# Altium schematic sheet SBH_Microcontroller.SchDoc: Microcontroller
size B; Date: 10/12/2022; Author: Ethan Garrett; Organization: ORGANIZATION; Address1: ADDRESS 1; Address2: ADDRESS 2; Address3: ADDRESS 3; Address4: ADDRESS 4; Revision: -; SheetNumber: 1; SheetTotal: 3; ENG_APP_DATE: --/--/--; DSN_APP_DATE: --/--/--; CHK_APP_DATE: --/--/--
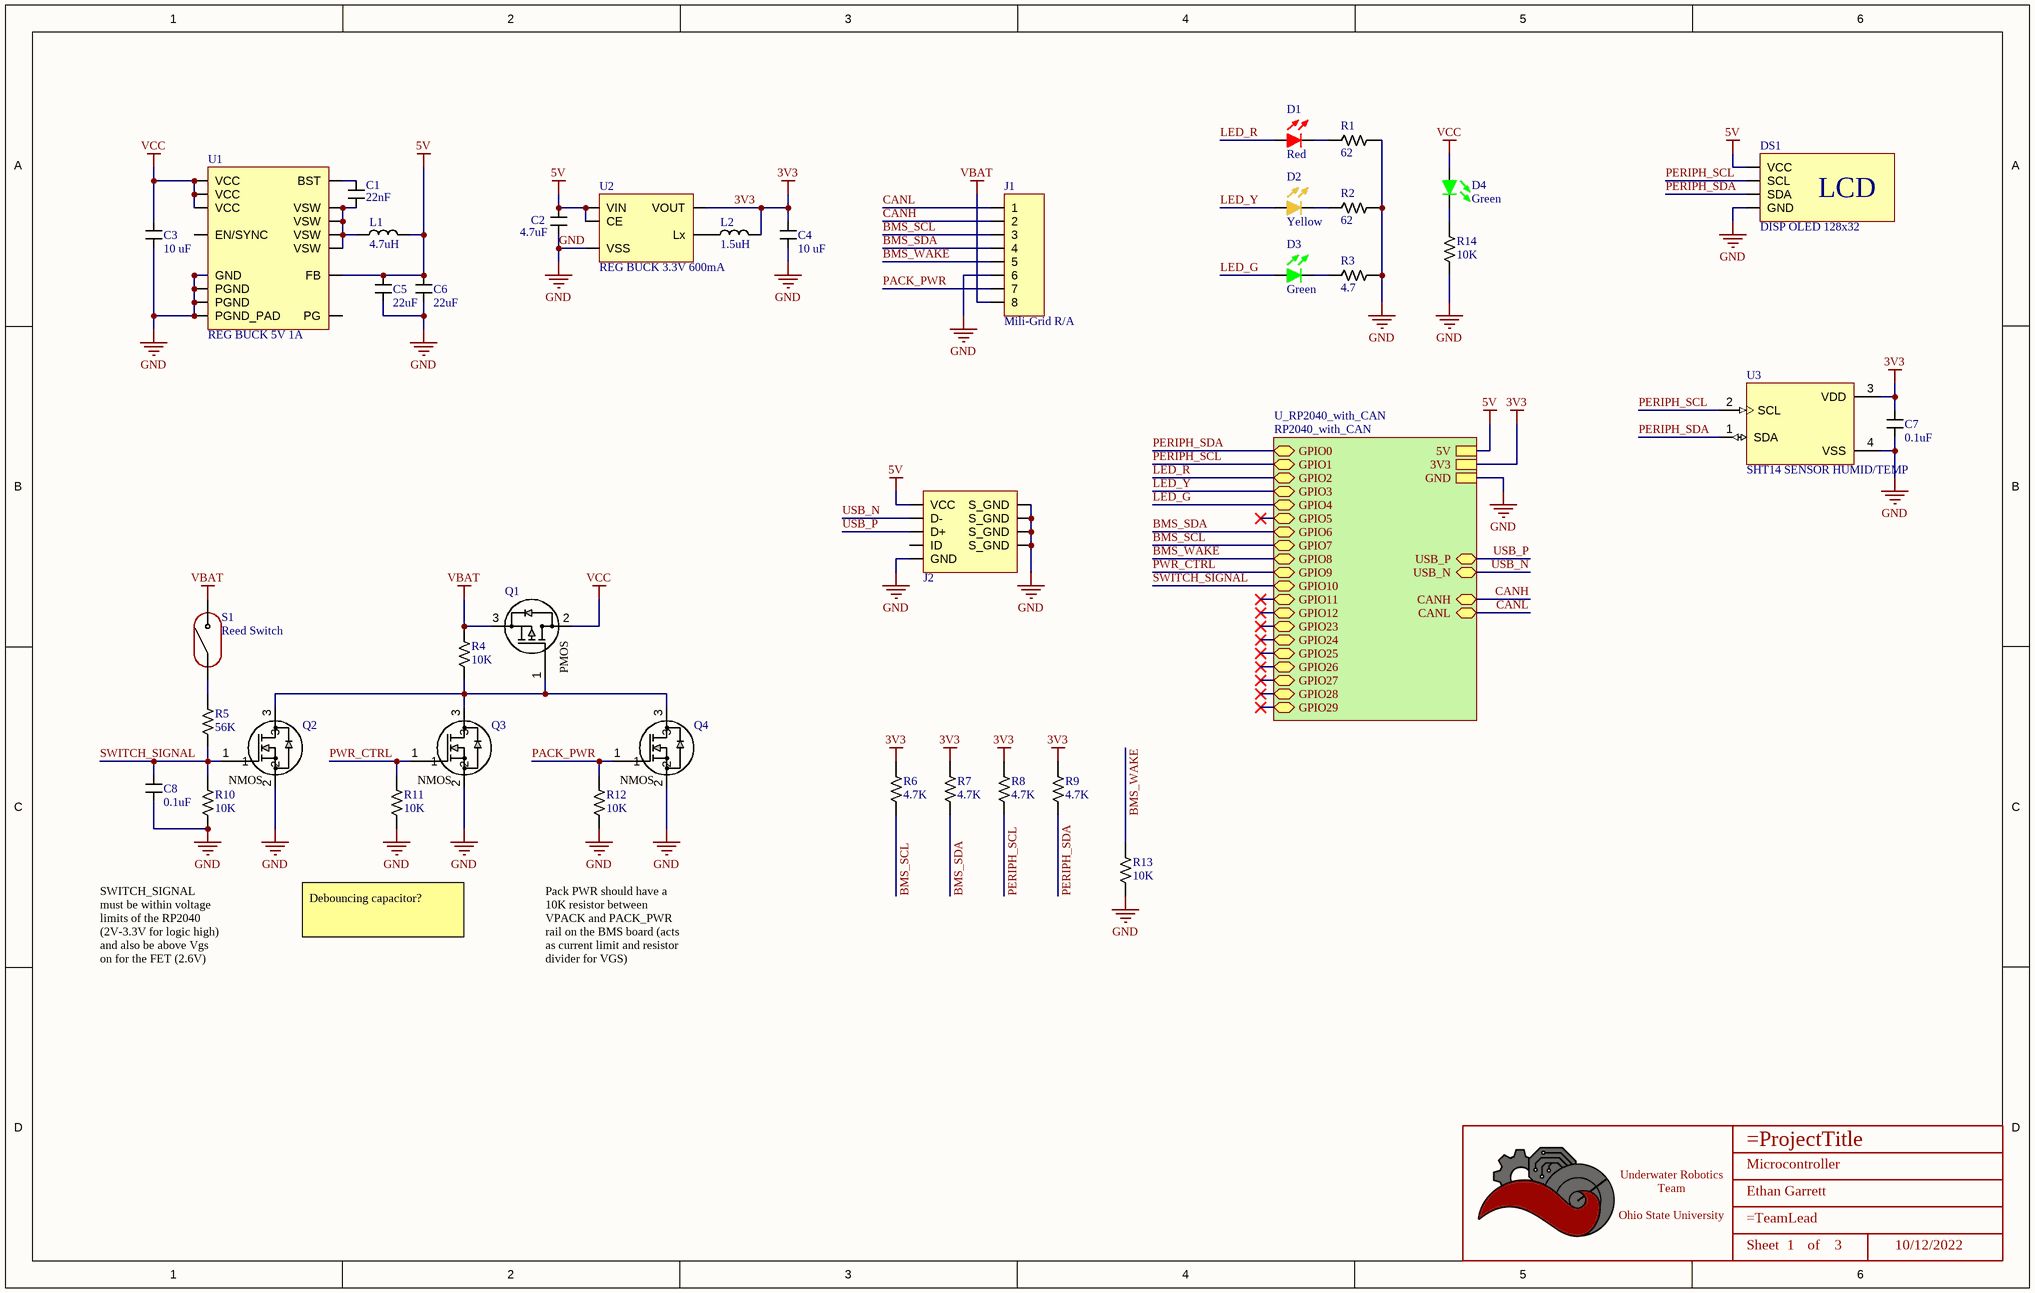
[diagram p0: SBH_Microcontroller.SchDoc]

## Parts
*  Title_Block  [LOGO]  (value not drawn)  (graphical)
C1  value 22nF  [CAPACITOR_0402]  (hidden comment: 22nF Ceramic 25V)
C2  value 4.7uF  [CAPACITOR_0603]  (hidden comment: 4.7uF Ceramic 6.3V)
C3  Value (uF): 10 uF  [CAPACITOR_1206]  (hidden comment: 10uF Ceramic 25V)
C4  Value (uF): 10 uF  [CAPACITOR_0603]  (hidden comment: 10uF Ceramic 6.3V)
C5  value 22uF  [CAPACITOR_0805]  (hidden comment: 22uF Ceramic 10V)
C6  value 22uF  [CAPACITOR_0805]  (hidden comment: 22uF Ceramic 10V)
C7  value 0.1uF  [CAPACITOR_0402]  (hidden comment: 100nF Ceramic 25V)
C8  value 0.1uF  [CAPACITOR_0402]  (hidden comment: 100nF Ceramic 25V)
D1  Color: Red  [LED_0603]  (hidden comment: 150060RS75000)
D2  Color: Yellow  [LED_0603]  (hidden comment: 150060YS75000)
D3  Color: Green  [LED_0603]  (hidden comment: 150060GS75000)
D4  Color: Green  [LED_0603]  (hidden comment: 150060GS75000)
DS1  DISP OLED 128x32  [OLED_I2C_128x32]
J1  Mili-Grid R/A  [Molex_Mili-Grid_2x4PIN_2.00MM_RA]
J2  USB_MICRO R/A  [CONN_MINIUSB]  (value not drawn)
L1  value 4.7uH  [INDUCTOR_SLF7045]  (hidden comment: 4.7uH Shielded Drum Core)
L2  value 1.5uH  [INDUCTOR_NR3015]  (hidden comment: 1.5uH Shielded)
Q1  DMP3056L-7  [SOT-23-3]  (value not drawn)
Q2  MOSFET N-CH 30V 5.8A SOT-23-3  [SOT-23-3]  (value not drawn)
Q3  MOSFET N-CH 30V 5.8A SOT-23-3  [SOT-23-3]  (value not drawn)
Q4  MOSFET N-CH 30V 5.8A SOT-23-3  [SOT-23-3]  (value not drawn)
R1  Value  (Ohms): 62  [RESISTOR_0603]  (hidden comment: 62 Ohm 1% 1/4W)
R2  Value  (Ohms): 62  [RESISTOR_0603]  (hidden comment: 62 Ohm 1% 1/4W)
R3  Value  (Ohms): 4.7  [RESISTOR_0603]  (hidden comment: 4.7 Ohm 5% 1/8W)
R4  Value  (Ohms): 10K  [RESISTOR_0603]  (hidden comment: 10k Ohm 5% 1/10W)
R5  Value  (Ohms): 56K  [RESISTOR_0402]  (hidden comment: 56k Ohm 1% 1/16W)
R6  Value  (Ohms): 4.7K  [RESISTOR_0603]  (hidden comment: 4.7k Ohm 5% 1/10W)
R7  Value  (Ohms): 4.7K  [RESISTOR_0603]  (hidden comment: 4.7k Ohm 5% 1/10W)
R8  Value  (Ohms): 4.7K  [RESISTOR_0603]  (hidden comment: 4.7k Ohm 5% 1/10W)
R9  Value  (Ohms): 4.7K  [RESISTOR_0603]  (hidden comment: 4.7k Ohm 5% 1/10W)
R10  Value  (Ohms): 10K  [RESISTOR_0603]  (hidden comment: 10k Ohm 5% 1/10W)
R11  Value  (Ohms): 10K  [RESISTOR_0603]  (hidden comment: 10k Ohm 5% 1/10W)
R12  Value  (Ohms): 10K  [RESISTOR_0603]  (hidden comment: 10k Ohm 5% 1/10W)
R13  Value  (Ohms): 10K  [RESISTOR_0603]  (hidden comment: 10k Ohm 5% 1/10W)
R14  Value  (Ohms): 10K  [RESISTOR_0603]  (hidden comment: 10k Ohm 5% 1/10W)
S1  Reed Switch  [MDSR-7]
U1  REG BUCK 5V 1A  [QFN-16 (3x3)]
U2  REG BUCK 3.3V 600mA  [SOT-23-5]
U3  SHT14 SENSOR HUMID/TEMP  [XDCR_SHT41-AD1B-R2]

## Sub-sheets
U_RP2040_with_CAN = RP2040_with_CAN: USB_P (bidir), USB_N (bidir), 5V, CANH (bidir), CANL (bidir), GPIO0 (bidir), GPIO1 (bidir), GPIO2 (bidir), GPIO3 (bidir), GPIO4 (bidir), GPIO5 (bidir), GPIO6 (bidir), GPIO7 (bidir), GPIO8 (bidir), GPIO9 (bidir), GPIO10 (bidir), GPIO11 (bidir), GPIO12 (bidir), GPIO23 (bidir), GPIO24 (bidir), GPIO25 (bidir), GPIO26 (bidir), GPIO27 (bidir), GPIO28 (bidir), GPIO29 (bidir), 3V3, GND

## Nets
3V3: C4.1 C7.1 L2.1 R6.1 R7.1 R8.1 R9.1 U2.4(VOUT) U3.3(VDD) ; sheet U_RP2040_with_CAN/3V3
5V: C2.1 C5.1 C6.1 DS1.2(VCC) J2.1(VCC) L1.1 U1.5(FB) U2.1(VIN) U2.3(CE) ; sheet U_RP2040_with_CAN/5V
GND: C2.2 C3.2 C4.2 C5.2 C6.2 C7.2 C8.2 DS1.1(GND) J1.6 J2.5(GND) J2.6(S_GND) J2.7(S_GND) J2.8(S_GND) J2.9(S_GND) Q2.2 Q3.2 Q4.2 R1.1 R2.1 R3.1 R10.2 R11.2 R12.2 R13.2 R14.2 U1.4(GND) U1.14(PGND) U1.15(PGND) U1.17(PGND_PAD) U2.2(VSS) U3.4(VSS) ; sheet U_RP2040_with_CAN/GND
VBAT: J1.8 Q1.3 R4.1 S1.2
VCC: C3.1 D4.1 Q1.2 U1.2(VCC) U1.3(VCC) U1.11(VCC)
BMS_SCL: J1.3 R6.2 ; sheet U_RP2040_with_CAN/GPIO7
BMS_SDA: J1.4 R7.2 ; sheet U_RP2040_with_CAN/GPIO6
BMS_WAKE: J1.5 R13.1 ; sheet U_RP2040_with_CAN/GPIO8
CANH: J1.2 ; sheet U_RP2040_with_CAN/CANH
CANL: J1.1 ; sheet U_RP2040_with_CAN/CANL
LED_G: D3.1 ; sheet U_RP2040_with_CAN/GPIO4
LED_R: D1.1 ; sheet U_RP2040_with_CAN/GPIO2
LED_Y: D2.1 ; sheet U_RP2040_with_CAN/GPIO3
PACK_PWR: J1.7 Q4.1 R12.1
PERIPH_SCL: DS1.3(SCL) R8.2 U3.2(SCL) ; sheet U_RP2040_with_CAN/GPIO1
PERIPH_SDA: DS1.4(SDA) R9.2 U3.1(SDA) ; sheet U_RP2040_with_CAN/GPIO0
PWR_CTRL: Q3.1 R11.1 ; sheet U_RP2040_with_CAN/GPIO9
SWITCH_SIGNAL: C8.1 Q2.1 R5.2 R10.1 ; sheet U_RP2040_with_CAN/GPIO10
USB_N: J2.2(D-) ; sheet U_RP2040_with_CAN/USB_N
USB_P: J2.3(D+) ; sheet U_RP2040_with_CAN/USB_P
NetC1_1: C1.1 U1.10(BST)
NetC1_2: C1.2 L1.2 U1.1(VSW) U1.12(VSW) U1.13(VSW) U1.16(VSW)
NetD1_2: D1.2 R1.2
NetD2_2: D2.2 R2.2
NetD3_2: D3.2 R3.2
NetD4_2: D4.2 R14.1
NetL2_2: L2.2 U2.5(Lx)
NetQ1_1: Q1.1 Q2.3 Q3.3 Q4.3 R4.2
NetR5_1: R5.1 S1.1

Not connected (* = marked no-connect by the designer): J2 4(ID); U1 8(PG) 9(EN/SYNC)

## Notes on the sheet
- SWITCH_SIGNAL must be within voltage limits of the RP2040 (2V-3.3V for logic high) and also be above Vgs on for the FET (2.6V)
- Debouncing capacitor?
- Pack PWR should have a 10K resistor between VPACK and PACK_PWR rail on the BMS board (acts as current limit and resistor divider for VGS)
- DWG. NO.
- REV.
- SHT.
- THIS DOCUMENT AND THE DATA DISCLOSED HEREIN OR HEREWITH IS THE PROPERTY OF ALTIUM LIMITED AND MAY BE FREELY DISTRIBUTED IN WHOLE. NO RIGHTS ARE RESERVED OR EXPRESS OR IMPLIED WARANTEE GIVEN.
- REVISION
- DESCRIPTION
- DATE
- APPROVED
- ENG:
- APPROVALS
- PROJECT
- DSN:
- CHK:
- REFERENCE DOCUMENTS
- PROJECT REVISION:
- TITLE
- DOCUMENT REVISION:
- DESIGN ITEM:
- BOM:
- FAB DWG:
- PCB DWG:
- ASSY DWG:
- SCALE:
- SIZE
- B
- CAGE CODE
- FILE NAME
- DWG NO.
- SHEET
- OF
- REV
- (in symbol AO3404A) NMOS
- (in symbol DMP3056L-7) PMOS
- (in symbol OLED_I2C_128x32) LCD
- (in symbol Title_Block) Underwater Robotics Team / Ohio State University; Sheet; of

## Library data of the parts
* = Title_Block: UWRT Schematic Title Block Template / Created June 2021, Dylan Trainor
C1 = CAPACITOR_0.022uF_0402: Cap 22nF 25V +/-10% / Ceramic 0402; Made By: Robert Pafford; Tolerance: +/- 10%; Voltage: 25V; Supplier 1: Digi-Key; Supplier Part Number 1: 445-1261-1-ND
C2 = CAPACITOR_4.7uF_0603: Cap 4.7uF 6.3V +/-10% / Ceramic 0603; Made By: Robert Pafford; Tolerance: +/- 10%; Voltage: 6.3V; Supplier 1: Digi-Key; Supplier Part Number 1: 1276-2087-1-ND
C3 = CAPACITOR_10uF_1206: Cap 10uF 25V +/-10% / Ceramic 1206; Made By: Robert Pafford; Tolerance: +/- 10%; Voltage: 25V; Supplier 1: Digi-Key; Supplier Part Number 1: 1276-1804-6-ND
C4 = CAPACITOR_10uF_0603: Cap 10uF 6.3V +/-20% / Ceramic 0603; Made By: Flip B; ComponentLink1Description: Digikey; ComponentLink1URL: https://www.digikey.com/en/products/detail/samsung-electro-mechanics/CL10A106MQ8NNNC/3886777; Supplier 1: Digi-Key; Supplier Part Number 1: 1276-1119-1-ND; Tolerance: +/- 20%; Voltage: 6.3V
C5 C6 = CAPACITOR_22uF_0805: Cap 22uF 10V +/-20% X5R / Ceramic 0805; Made By: Robert Pafford; Tolerance: +/- 20%; Voltage: 10V; Supplier 1: Digi-Key; Supplier Part Number 1: 445-7665-6-ND
C7 C8 = CAPACITOR_0.1uF_0402: Cap 100nF 25V +/-10% / Ceramic 0402; Made By: Robert Pafford; Tolerance: +/- 10%; Voltage: 25V; Supplier 1: Digi-Key; Supplier Part Number 1: 478-7868-1-ND
D1 = LED_Red_0603: LED Red Vf= 2V If = 0.020A / 150060RS75000; Made By: Robert Pafford; Forward Current: 20mA; Forward Voltage: 2V; Package: 0603; Supplier 1: Digi-Key; Supplier Part Number 1: 732-4978-1-ND
D2 = LED_Yellow_0603: LED Yellow Vf= 2V If = 0.020A / 150060YS75000; Made By: Robert Pafford; Forward Current: 20mA; Forward Voltage: 2V; Package: 0603; Supplier 1: Digi-Key; Supplier Part Number 1: 732-4981-1-ND
D3 D4 = LED_Green_0603_3.2V: LED Green Vf= 3.2V If = 0.025A / 150060GS75000; Made By: Flip B; Forward Current: 25mA; Supplier 1: Digi-Key; ComponentLink1Description: Datasheet; ComponentLink1URL: https://www.we-online.de/katalog/datasheet/150060GS75000.pdf; Supplier Part Number 1: 732-4971-1-ND; Forward Voltage: 3.2V; Package: 0603
DS1 = OLED_I2C_128x32: 0.91'' 128x32 I2C OLED LCD Display Module; Made By: Robert Pafford; Input Voltage: 3.3V, 5V; Protocol: I2C; Display Size: 128x32
J1 = CONN_MOLEX_MiliGrid_8POS_R/A: Molex Mili-Grid 2.00mm pitch 8 Pos Right Angle; Current Per Pin: 1A; Number of Positions: 8; Manufacturer: Molex; Pitch: 2.00mm; Configuration: Right Angle; Color: Black; Created By: Flip B; ComponentLink1Description: Datasheet; ComponentLink1URL: https://www.molex.com/pdm_docs/sd/878330821_sd.pdf; Series: Mili-Grid; Supplier 1: Digi-Key; Supplier Part Number 1: WM23634-ND
J2 = CONN_MICROUSB: Amphenol Micro USB-B / USB2.0 5 Pin Right Angle SMD; Pitch: 0.65mm; Current Per Pin: 1.8A; Number of Positions: 5; Manufacturer: Amphenol; Configuration: Right Angle; Color: Silver; Created By: Flip B; ComponentLink1Description: Datasheet; ComponentLink1URL: https://cdn.amphenol-icc.com/media/wysiwyg/files/documentation/datasheet/inputoutput/io_usb_micro.pdf?__cf_chl_jschl_tk__=05693735e19256298f6ef6ca2bb2e65c376a4f56-1625503833-0-Abitsb0-ufjOXJYs_S3J3r2iTn-nObalbmXUksF1VvO_h_WEmRdMlUD1I8-hmWSEVWzY1pirKnrPZWfgY3851qyBZe5ZvnNQePLGIzUgdEIQBVUyW36RsbYpDLEWxJ4horD-5gChFgobLYqwmG5aHl0E8lIn_twwPPrOxilK2gP0q9t_CNOs_u5fMqXvXUrlsOv8tIE2NRlu6NVP8qtkL2GjhlkeTUbDMF8WvvpPDTFOgvZ4Y16Ej8F8AhWos88mo5B1HssXozw0XrkJQIqERITUu6rqloz9kf4ZzhBHtDAt-IkiAFY_Ds9SW8FYKKTtINJVpHZQ6Gyu1FFM4Dc9MO0maE8_mmNcwlxqyRoRk_MPWW8VyByXWM5RSp52jteRKw7FeI9WIYvCbPAOy0Eyib-aseIQsnGbglBcUY6_2xp8GYaJM38H3dNvBPsSOfJBPndKedwKHllxjkucXn6xsN0sDXkpGN-cu8_2bDTJ0g-uUucKSCooYX-ApSDNGpkA_p9zv1SOAD8c0zaZVmtiBsN75QpVz2rzq9_BFxOywPvR; Series: 10118192; Supplier 1: Digi-Key; Supplier Part Number 1: 609-4613-1-ND
L1 = INDUCTOR_4.7uH_SLF7045T: 4.7 µH Shielded Drum Core, Wirewound Inductor 2.1 A 36mOhm Max Nonstandard; Tolerance: +/- 20%; Made By: Robert Pafford; Current Rating: 2.1A; DC Resistance: 36mOhm; Supplier 1: Digi-Key; Supplier Part Number 1: 587-2617-1-ND
L2 = INDUCTOR_1.5uH_NR3015: Inductor Shielded 1.5uH 1.8A +/-30%; Made By: Robert Pafford; DC Resistance: 48mOhm; Tolerance: +/- 30%; Current Rating: 1.8A; Supplier 1: Digi-Key; Supplier Part Number 1: 587-2617-1-ND
Q1 = DMP3056L-7: P-Channel 30V 4.3A (Ta) 1.38W (Ta) Surface Mount SOT23; Reviewed By: ---; VDSS (Max): -30V; Vgss (Max): +-25V; Id: -4.3A; Created By: John Ulm; Supplier 1: Digi-Key; Supplier Part Number 1: DMP3056L-7DICT-ND
Q2-Q4 = AO3404A: N-Channel 30 V 5.8A (Ta) 1.4W (Ta) Surface Mount SOT-23-3; Vendor: Alpha & Omega Semiconductor Inc.; SourceLibrary: ON_Semiconductor_2020-01-13; Vgs (Max): 3V @ 5.8A, 10V; Vgs (th): 3V @ 250µA; Rds (on): 28mOhm @ 5.8A, 10V; Amp Rating: 5.8 A; FET Type: N-Channel; Package: SOT23-3L; Manufacturer _Part_Number: AO3404A; Vdss: 30V; Power Dissipation: 1.4W (Ta); Supplier 1: Digi-Key; Supplier Part Number 1: 785-1004-1-ND; Created By: Dylan T
R1 R2 = RESISTOR_62_0603: RES SMD 62 OHM 1% 1/4W 0603; Tolerance: +/- 1%; Made By: Robert Pafford; ComponentLink1Description: Datasheet; ComponentLink1URL: https://www.bourns.com/docs/product-datasheets/CRxxxxx.pdf; Wattage: 1/4W; Supplier: Digikey; Digikey Part Numer: CR0603-JW-104ELFTR-ND; Supplier 1: Digi-Key; Supplier Part Number 1: 541-RCS060362R0FKEACT-ND
R3 = RESISTOR_4.7_0603: RES 4.7 OHM 5% 1/8W 0603; Tolerance: +/- 5%; Made By: Robert Pafford; Wattage: 1/8W; Supplier: Digikey; Digikey Part Numer: CR0603-JW-104ELFTR-ND; Supplier 1: Digi-Key; Supplier Part Number 1: 2019-RK73B1JTTD4R7JCT-ND
R4 R10-R14 = RESISTOR_10K_0603: RES 10k OHM 5% 1/10W 0603; Tolerance: +/- 5%; Wattage: 1/8W; Made By: Robert Pafford; ComponentLink1Description: Datasheet; ComponentLink1URL: https://www.bourns.com/docs/product-datasheets/CRxxxxx.pdf; Supplier: Digikey; Digikey Part Numer: CR0603-JW-104ELFTR-ND; Supplier 1: Digi-Key; Supplier Part Number 1: 2019-RK73B1JTTD103JCT-ND
R5 = RESISTOR_56K_0402: RES 56k OHM 1% 1/16W 0402; Tolerance: +/- 1%; Made By: Robert Pafford; Wattage: 1/16W; Supplier 1: Digi-Key; Supplier Part Number 1: YAG3501CT-ND
R6-R9 = RESISTOR_4.7K_0603: RES 4.7k OHM 5% 1/10W 0603; Tolerance: +/- 5%; Made By: Robert Pafford; Wattage: 1/10W; Supplier: Digikey; Digikey Part Numer: CR0603-JW-104ELFTR-ND; Supplier 1: Digi-Key; Supplier Part Number 1: RMCF0603JT4K70CT-ND
S1 = Reed Switch: Glass Body Reed Switch SPST-NO 10 ~ 20AT Operate Range 10W 350mA (AC), 500mA (DC) 140 V Through Hole; Made By: Robert Pafford; Switching Voltage (DC): 200V; Supplier 1: Digi-Key; Supplier Part Number 1: HE500-ND; Max Power: 10W; Max Current (DC): 500 mA
U1 = TS30041-M050QFNR: Buck Switching Regulator IC Positive Fixed 5V 1 Output 1A 16-VFQFN Exposed Pad; Made By: Robert Pafford; Output Voltage: 5V (Fixed); Max Input Voltage: 40V; Max Current: 1A; Supplier 1: Digi-Key; Supplier Part Number 1: TS30041-M050QFNRCT-ND
U2 = XC9236A33DMR-G: Buck Switching Regulator IC Positive Fixed 3.3V 1 Output 600mA SOT25; Made By: Robert Pafford; Output Voltage: 3.3V (Fixed); Max Input Voltage: 6V; Max Current: 600 mA; Supplier 1: Digi-Key; Supplier Part Number 1: 893-1162-1-ND
U3 = SHT41-AD1B-R2: Digital Relative Humidity Temperature Sensor, Â±1.8 / max 2.5 %RH, Â±0.2 Â°C, Ultra-Low-Power; MF: Sensirion; Price: None; SnapEDA_Link: https://www.snapeda.com/parts/SHT41-AD1B-R2/Sensirion/view-part/?ref=snap; MP: SHT41-AD1B-R2; Purchase-URL: https://pricing.snapeda.com/search/part/SHT41-AD1B-R2/?ref=eda; Value: *; Availability: In Stock; Package: None; Check_prices: https://www.snapeda.com/parts/SHT41-AD1B-R2/Sensirion/view-part/?ref=eda; Supplier 1: Digi-Key; Supplier Part Number 1: 1649-SHT41-AD1B-R2CT-ND